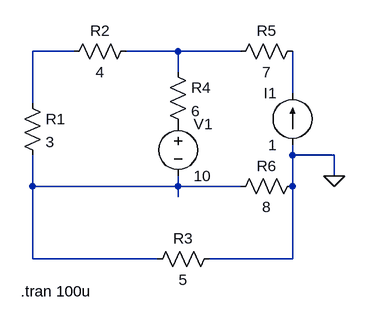
[diagram p0: schematic task_01_v02.asc]
task_01_v02.asc, the LTspice schematic file:
Version 4
SHEET 1 880 680
WIRE 256 -432 192 -432
WIRE 416 -432 336 -432
WIRE 512 -432 416 -432
WIRE 416 -400 416 -432
WIRE 592 -368 592 -432
WIRE 192 -352 192 -432
WIRE 592 -272 592 -288
WIRE 656 -272 592 -272
WIRE 656 -240 656 -272
WIRE 192 -224 192 -272
WIRE 416 -224 416 -240
WIRE 416 -224 192 -224
WIRE 512 -224 416 -224
WIRE 592 -224 592 -272
WIRE 416 -208 416 -224
WIRE 192 -112 192 -224
WIRE 384 -112 192 -112
WIRE 592 -112 592 -224
WIRE 592 -112 464 -112
FLAG 656 -240 0
SYMBOL res 176 -368 R0
SYMATTR InstName R1
SYMATTR Value 3
SYMBOL res 352 -448 R90
WINDOW 0 0 56 VBottom 2
WINDOW 3 32 56 VTop 2
SYMATTR InstName R2
SYMATTR Value 4
SYMBOL res 368 -96 R270
WINDOW 0 32 56 VTop 2
WINDOW 3 0 56 VBottom 2
SYMATTR InstName R3
SYMATTR Value 5
SYMBOL res 400 -416 R0
SYMATTR InstName R4
SYMATTR Value 6
SYMBOL res 608 -448 R90
WINDOW 0 0 56 VBottom 2
WINDOW 3 32 56 VTop 2
SYMATTR InstName R5
SYMATTR Value 7
SYMBOL res 608 -240 R90
WINDOW 0 0 56 VBottom 2
WINDOW 3 32 56 VTop 2
SYMATTR InstName R6
SYMATTR Value 8
SYMBOL current 592 -288 R180
WINDOW 0 24 80 Left 2
WINDOW 3 24 0 Left 2
WINDOW 123 0 0 Left 0
WINDOW 39 0 0 Left 0
SYMATTR InstName I1
SYMATTR Value 1
SYMBOL voltage 416 -336 R0
WINDOW 123 0 0 Left 0
WINDOW 39 0 0 Left 0
SYMATTR InstName V1
SYMATTR Value 10
TEXT 174 -62 Left 2 !.tran 100u

The netlist it stands for:
* task_01_v02.asc
R1 N001 N004 3
R2 N002 N001 4
R3 N004 0 5
R4 N002 P001 6
R5 N003 N002 7
R6 0 N004 8
I1 0 N003 1
V1 P001 N004 10
.tran 100u
.backanno
.end